# Altium schematic sheet 2019-07-21_03-39-471.schdoc
size 392 x 119 mm; SheetNumber: 1; SheetTotal: 1
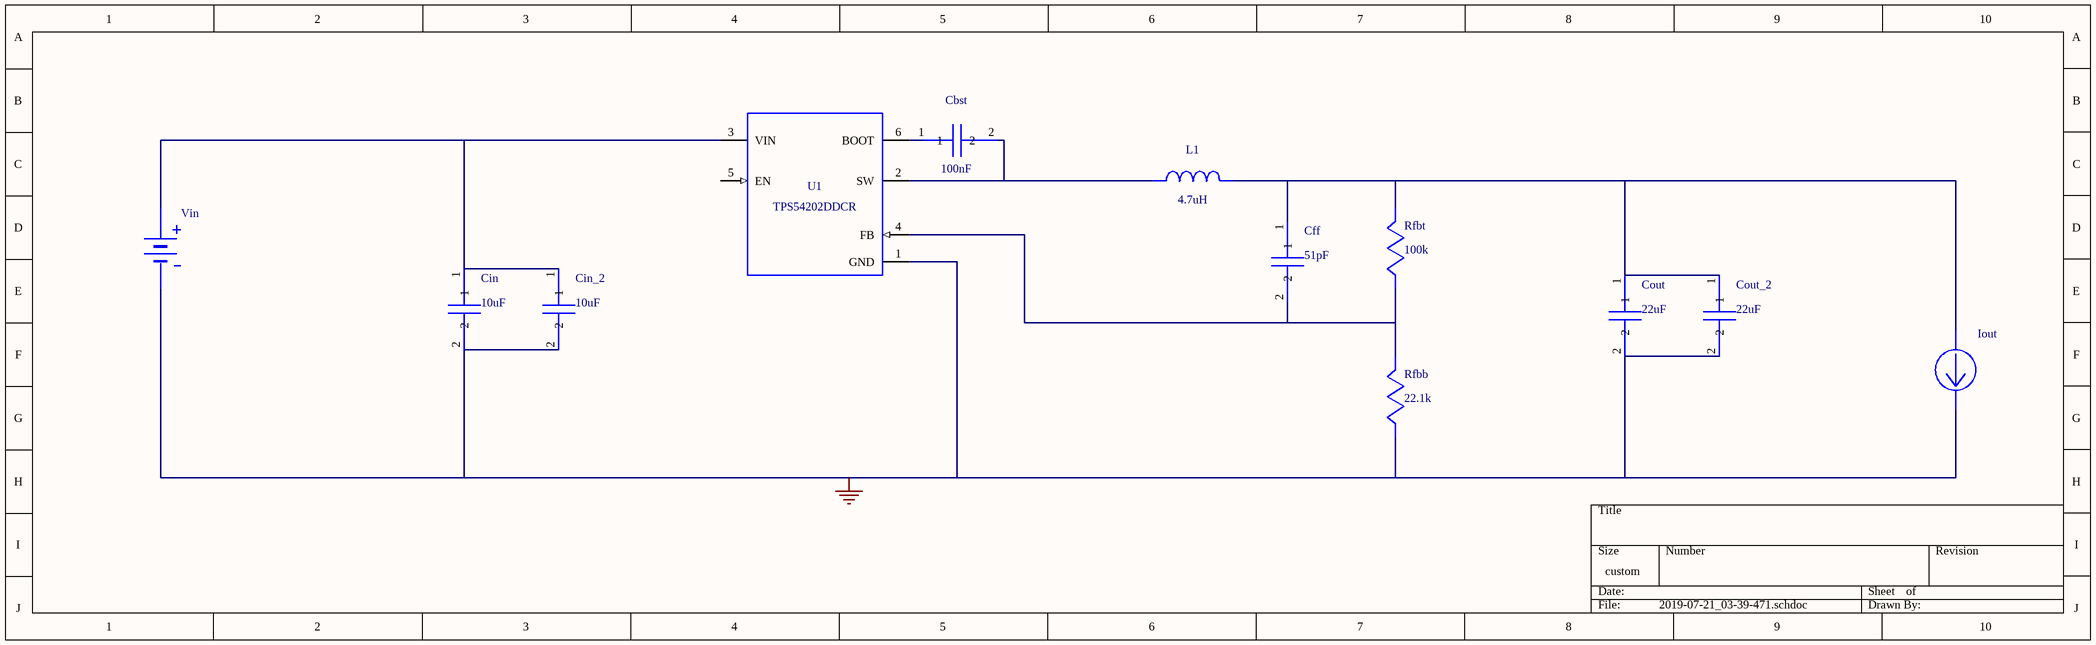
[diagram p0: 2019-07-21_03-39-471.schdoc]

## Parts
Cbst  value 100nF  (hidden comment: CGA3E2X7R1H104K080AA)
Cff  value 51pF  (hidden comment: CL21C510JBANNNC)
Cin  value 10uF  (hidden comment: CL32B106KBJNNWE)
Cin_2  value 10uF  (hidden comment: CL32B106KBJNNWE)
Cout  value 22uF  (hidden comment: TMK325B7226KMHP)
Cout_2  value 22uF  (hidden comment: TMK325B7226KMHP)
Iout  WB_CURRENT_LOAD  (value not drawn)
L1  value 4.7uH  (hidden comment: SRN6045-4R7Y)
Rfbb  value 22.1k  (hidden comment: CRCW040222K1FKED)
Rfbt  value 100k  (hidden comment: CRCW0402100KFKED)
U1  TPS54202DDCR
Vin  WB_BATTERY  (value not drawn)

## Nets
0: Cin.2 Cin_2.2 Cout.2 Cout_2.2 Iout.2(-) Rfbb.2 U1.1(GND) Vin.2(-)
NetCbst_1: Cbst.1 U1.6(BOOT)
NetCbst_2: Cbst.2 L1.1 U1.2(SW)
NetCff_1: Cff.1 Cout.1 Cout_2.1 Iout.1(+) L1.2 Rfbt.1
NetCff_2: Cff.2 Rfbb.1 Rfbt.2 U1.4(FB)
NetCin_1: Cin.1 Cin_2.1 U1.3(VIN) Vin.1(+)

Not connected (* = marked no-connect by the designer): U1 5(EN)

## Library data of the parts
Cbst = CGA3E2X7R1H104K080AA: CGA3E2X7R1H104K0; Manufacturer Name: TDK; PackageReference: CGA3E2X7R1H104K080AA; Manufacturer Part Number: CGA3E2X7R1H104K080AA
Cff = CL21C510JBANNNC: Manufacturer Name: Samsung Electro-Mechanics; PackageReference: CL21C510JBANNNC; Manufacturer Part Number: CL21C510JBANNNC
Cin Cin_2 = CL32B106KBJNNWE: Manufacturer Name: Samsung Electro-Mechanics; PackageReference: CL32B106KBJNNWE; Manufacturer Part Number: CL32B106KBJNNWE
Cout Cout_2 = TMK325B7226KMHP: Manufacturer Name: Taiyo Yuden; PackageReference: TMK325B7226KMHP; Manufacturer Part Number: TMK325B7226KMHP
L1 = SRN6045-4R7Y: Manufacturer Name: Bourns; PackageReference: SRN6045-4R7Y; Manufacturer Part Number: SRN6045-4R7Y
Rfbb = CRCW040222K1FKED: Manufacturer Name: Vishay-Dale; PackageReference: CRCW040222K1FKED; Manufacturer Part Number: CRCW040222K1FKED
Rfbt = CRCW0402100KFKED: Manufacturer Name: Vishay-Dale; PackageReference: CRCW0402100KFKED; Manufacturer Part Number: CRCW0402100KFKED
U1 = TPS54202DDCR: Manufacturer Name: Texas Instruments; PackageReference: TPS54202DDCR; Manufacturer Part Number: TPS54202DDCR; Value: N/A
Iout = WB_CURRENT_LOAD: PackageReference: WB_CURRENT_LOAD; Manufacturer Part Number: WB_CURRENT_LOAD; Manufacturer Name: WB_CURRENT_LOAD; Value: N/A
Vin = WB_BATTERY: PackageReference: WB_BATTERY; Manufacturer Part Number: WB_BATTERY; Manufacturer Name: WB_BATTERY; Value: N/A